# EAGLE design Enclosure 85x58 SP (EAGLE 9.6.2)
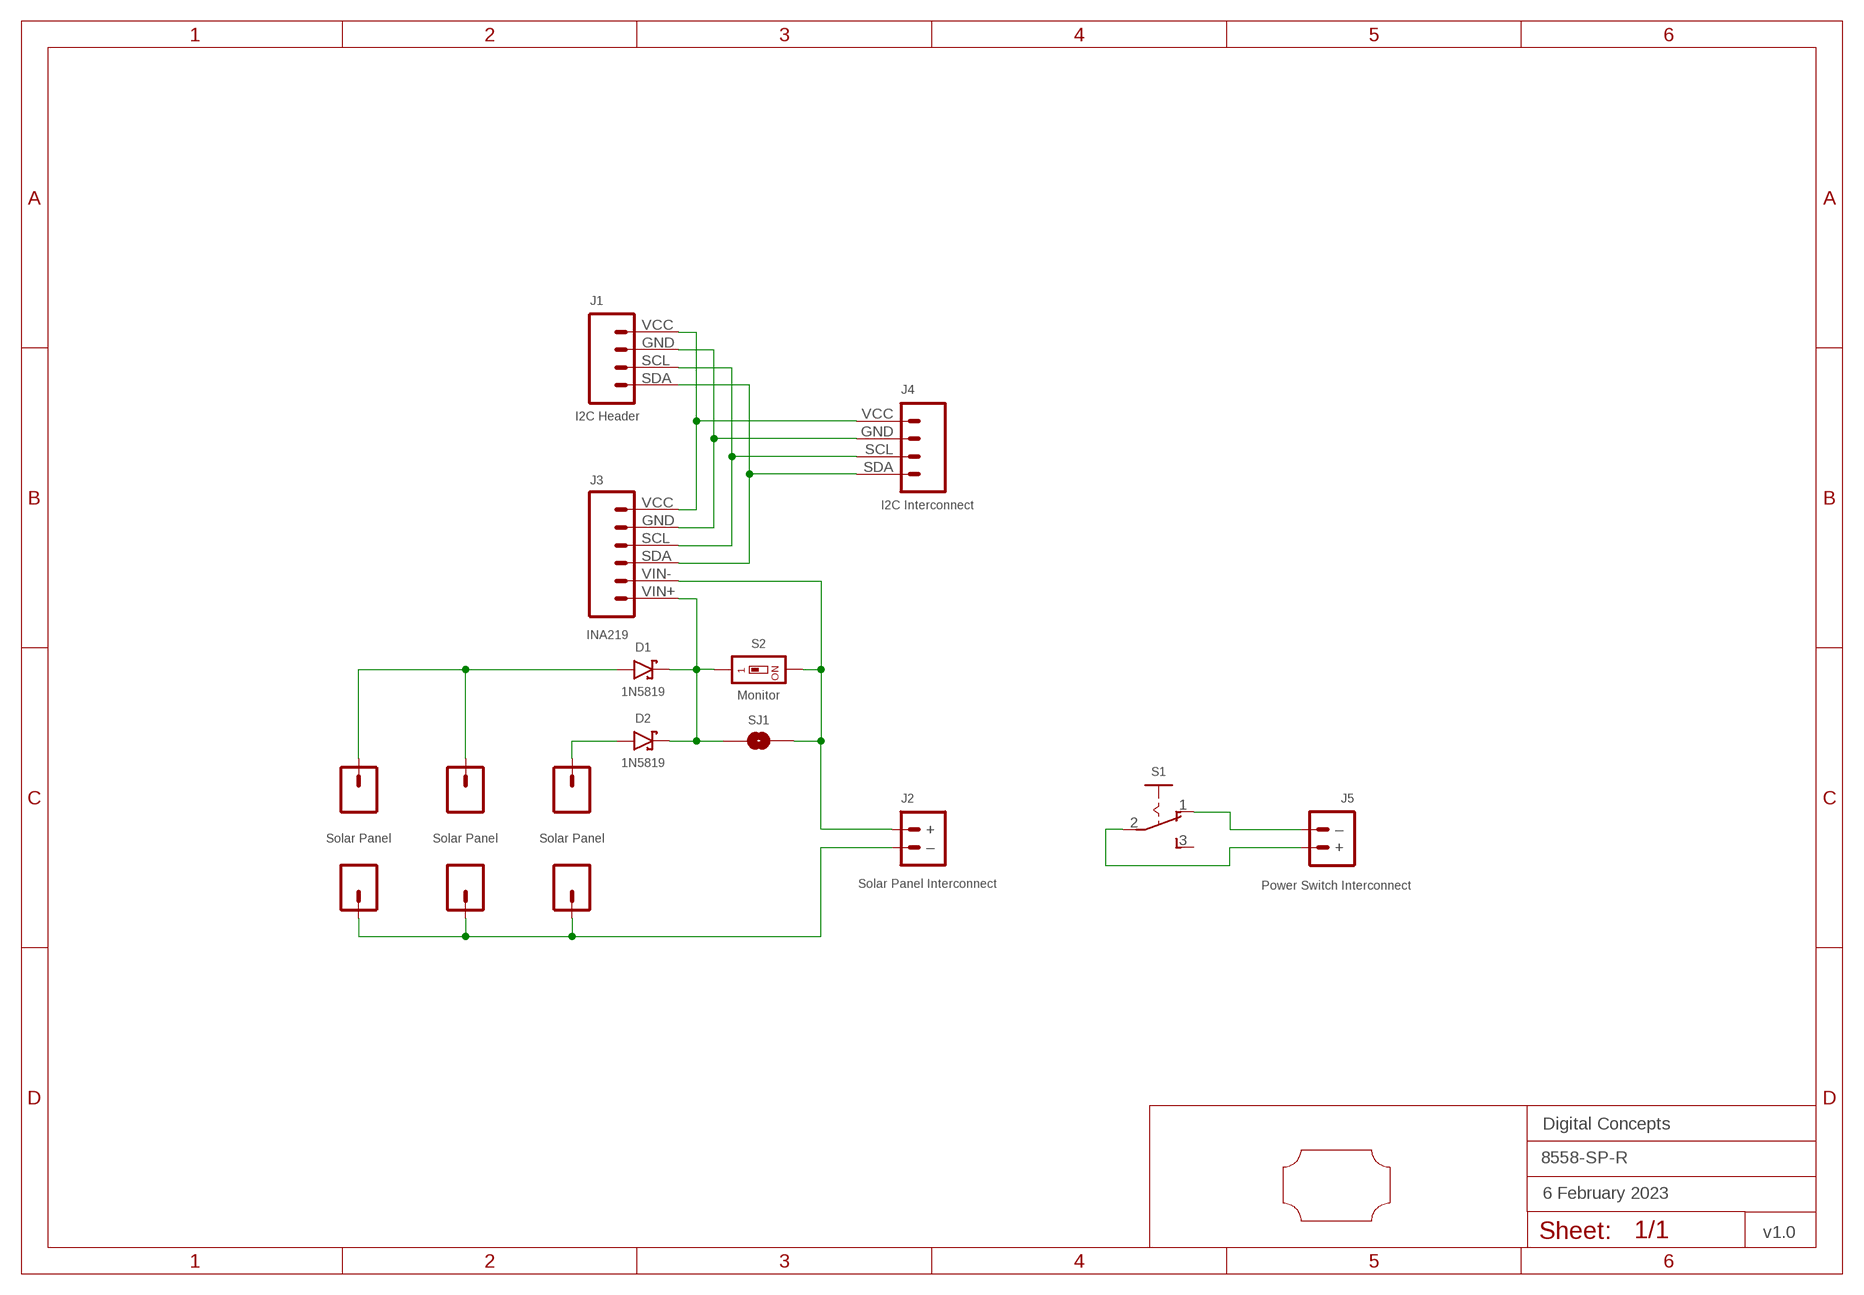
[diagram p0: schematic, sheet 1]
FRAME2 (FRAME-A4L-LOC): DATE: 6 February 2023; OWNER: Digital Concepts; TITLE: 8558-SP-R; VERSION: v1.0

## Parts
+  Solar Panel  PAD-SMD-GENERIC-SQUARE  [PAD-SMD-GENERIC]
+1  Solar Panel  PAD-SMD-GENERIC-SQUARE  [PAD-SMD-GENERIC]
+2  Solar Panel  PAD-SMD-GENERIC-SQUARE  [PAD-SMD-GENERIC]
-  Solar Panel  PAD-SMD-GENERIC-SQUARE  [PAD-SMD-GENERIC]
-1  Solar Panel  PAD-SMD-GENERIC-SQUARE  [PAD-SMD-GENERIC]
-2  Solar Panel  PAD-SMD-GENERIC-SQUARE  [PAD-SMD-GENERIC]
D1  1N5819  DIODE-SCHOTTKY-1N5819  [SOD-123]
D2  1N5819  DIODE-SCHOTTKY-1N5819  [SOD-123]
J1  I2C Header  HEADER-1X4-I2C  [CONN_04-I2C]
J2  Solar Panel Interconnect  JST-PH2.0-2-HORIZONTALJST-PTH-2  [JST-PH2.0-2-HORIZONTAL]
J3  INA219  INA219-I2C-MODULE  [CONN_06-INA219]
J4  I2C Interconnect  JST-PH2.0-4-I2C-HORIZONTAL  [JST-PH2.0-4-HORIZONTAL]
J5  Power Switch Interconnect  JST-PH2.0-2-HORIZONTALJST-PTH-2  [JST-PH2.0-2-HORIZONTAL]
S1  SWITCH-SLIDE-SPDT  [SWITCH-SPDT-PTH]
S2  Monitor  SWITCH-DIP-SWS001  [SMD-001]
SJ1  SJ  [SJ]
U$1  PROTO-28X18-SP  [PROTO-28X18-SP]

## Nets
GND: J1.GND J3.GND J4.GND
N$1: J1.SDA J3.SDA J4.SDA
N$2: J1.SCL J3.SCL J4.SCL
N$3: -1.P$1 -2.P$1 -.P$1 J2.2(–)
N$4: J2.1(+) J3.VIN- S2.2 SJ1.2
N$5: D1.C D2.C J3.VIN+ S2.1 SJ1.1
N$6: J5.1(+) S1.2(P)
N$7: +1.P$1 +2.P$1 D1.A
N$8: +.P$1 D2.A
N$9: J5.2(–) S1.1(O)
VCC: J1.VCC J3.VCC J4.VCC
Unconnected: S1.3(S)

## Library data of the parts
+ +1 +2 - -1 -2 = digitalconcepts:PAD-SMD-GENERIC-SQUARE: SMD Pad—Square
D1 D2 = digitalconcepts:DIODE-SCHOTTKY-1N5819: 1N5819 Schottky Diode SOD-123
J1 = digitalconcepts:HEADER-1X4-I2C: I2C Interface [Pin 1 Vcc] 4-Pin Header
J2 J5 = digitalconcepts:JST-PH2.0-2-HORIZONTAL: PH2.0 2P Right Angle PCB Connector; PROD_ID: CONN-09863; SKU: PRT-09914
J3 = digitalconcepts:INA219-I2C-MODULE: INA219 I2C Module
J4 = digitalconcepts:JST-PH2.0-4-I2C-HORIZONTAL: PH2.0 4P I2C Horizontal Connector
S1 = digitalconcepts:SWITCH-SLIDE-SPDT: Mini Sliding Switch SPDT
S2 = digitalconcepts:SWITCH-DIP-SWS001: SMD Dip Switch 1 pol.
SJ1 = digitalconcepts:SJ: Solder Jumper
U$1 = digitalconcepts:PROTO-28X18-SP: 28 x 18 Prototyping board to fit an 85 x 58 enclosure—Solar panel support

## Board
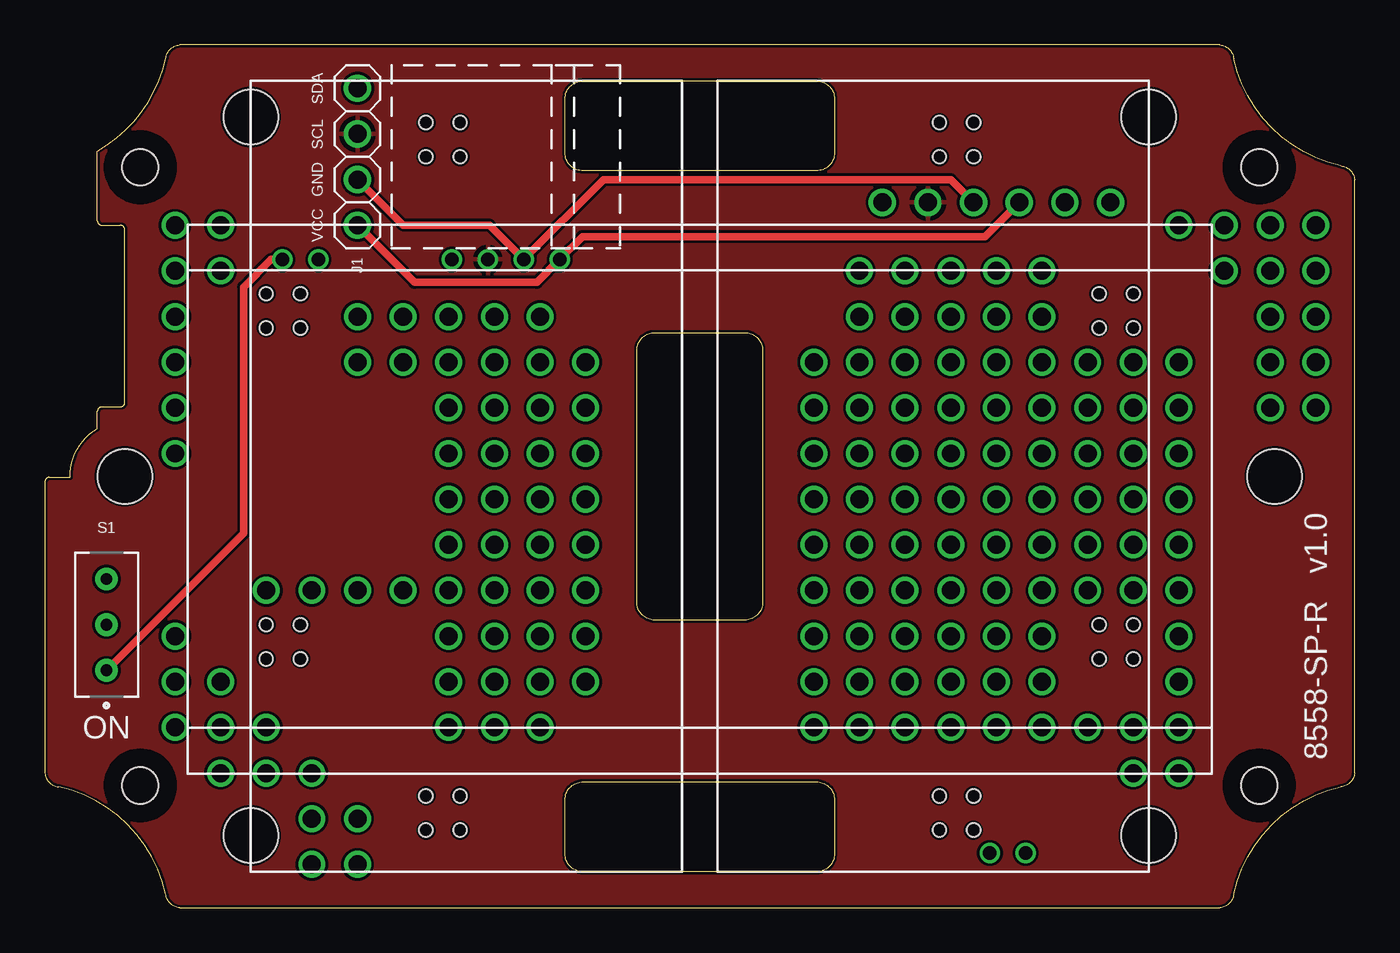
[diagram p1: board, top side]
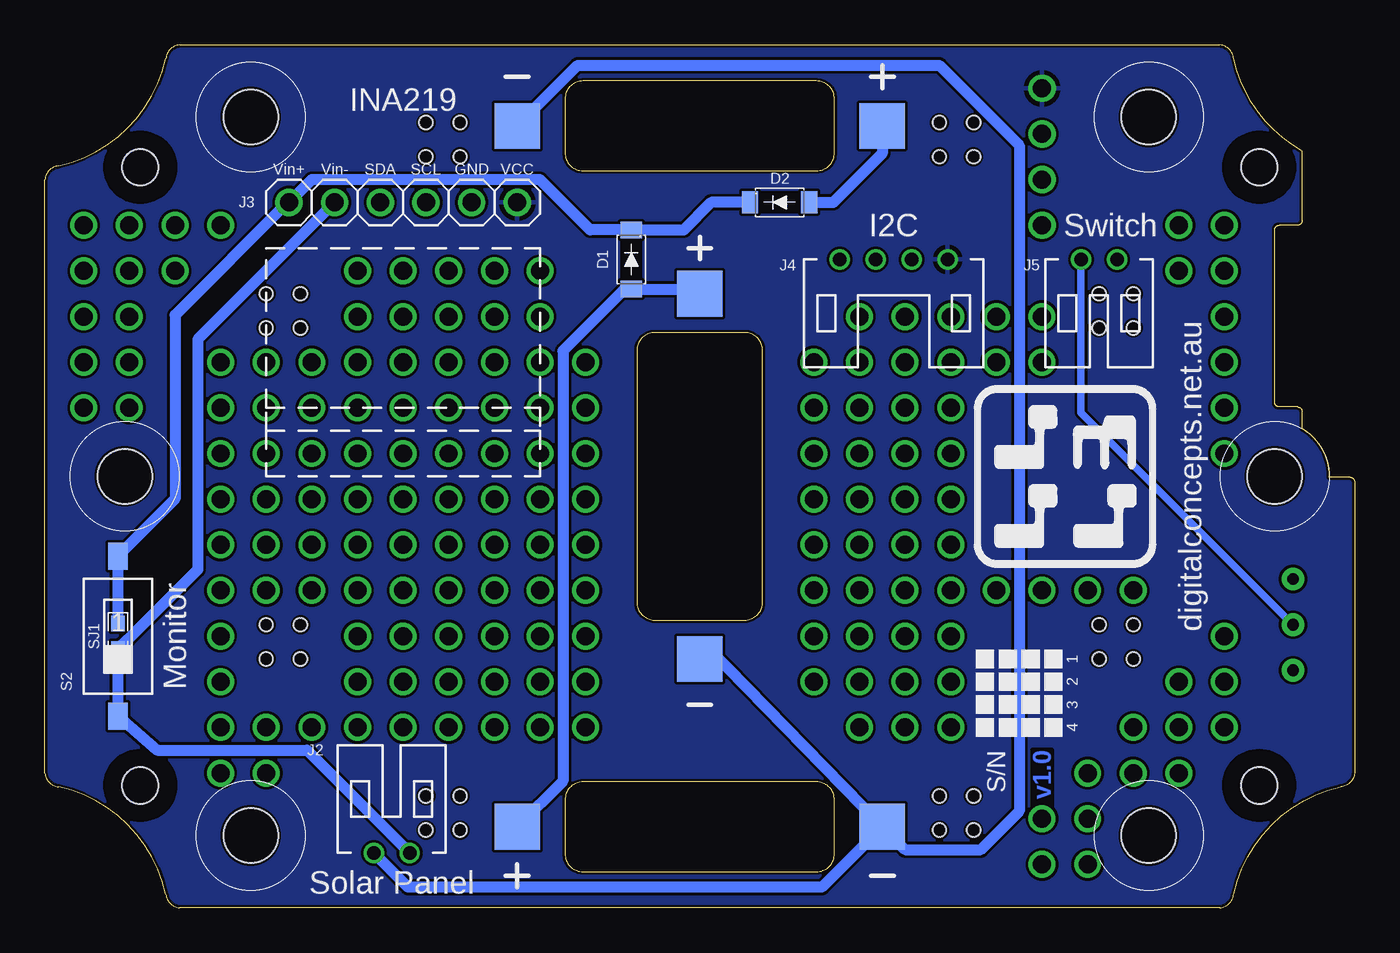
[diagram p2: board, bottom side, seen from below]

Size 72.9 x 48.01 mm. Coordinates in mm from the lower left corner, seen from the top.
Copper layers (1*16): Top 0.035mm / dielectric 1.5mm / Bottom 0.035mm
Design rules "default *": minimum track width 6mil, minimum drill 0.35mm, track to track 6mil, track to pad 6mil, pad to pad 6mil, via to via 6mil, smd to smd 6mil, copper to edge 6mil, drill to drill 6mil, minimum pad ring 1mil, minimum via ring 8mil, stop-mask expansion 4mil, vias tented up to drill 0mil, thermal gap 10mil

### Footprints (pad centres in the part's own frame; a part is rotated, then mirrored left to right if it is on the bottom)
PAD-SMD-GENERIC = smd 2.54 x 2.54: P$1 0,0
SOD-123 = smd 0.91 x 1.22: A -1.65,0; C 1.65,0
CONN_04-I2C = drill 1 pad 1.524: GND 2.54,0; SCL 5.08,0; SDA 7.62,0; VCC 0,0
JST-PH2.0-2-HORIZONTAL = drill 0.75: 1 1,0; 2 -1,0
CONN_06-INA219 = drill 1 pad 1.524: GND 2.54,0; SCL 5.08,0; SDA 7.62,0; VCC 0,0; VIN+ 12.7,0; VIN- 10.16,0
JST-PH2.0-4-HORIZONTAL = drill 0.75: GND -1,0; SCL 1,0; SDA 3,0; VCC -3,0
SWITCH-SPDT-PTH = drill 0.65 pad 1.27: 1 -2.54,0; 2 0,0; 3 2.54,0
SMD-001 = smd 1.1 x 1.5: 1 0,-4.45; 2 0,4.45
SJ = smd 0.864 x 0.762: 1 -0.711,0; 2 0.711,0
PROTO-28X18-SP = drill 1: P03-04 -29.21,-13.97; P03-05 -29.21,-11.43; P03-06 -29.21,-8.89; P03-10 -29.21,1.27; P03-11 -29.21,3.81; P03-12 -29.21,6.35; P03-13 -29.21,8.89; P03-14 -29.21,11.43; P03-15 -29.21,13.97; P04-03 -26.67,-16.51; P04-04 -26.67,-13.97; P04-05 -26.67,-11.43; P04-14 -26.67,11.43; P04-15 -26.67,13.97; P05-03 -24.13,-16.51; P05-04 -24.13,-13.97; P05-07 -24.13,-6.35; P06-01 -21.59,-21.59; P06-02 -21.59,-19.05; P06-03 -21.59,-16.51; P06-07 -21.59,-6.35; P07-01 -19.05,-21.59; P07-02 -19.05,-19.05; P07-07 -19.05,-6.35; P07-12 -19.05,6.35; P07-13 -19.05,8.89; P08-07 -16.51,-6.35; P08-12 -16.51,6.35; P08-13 -16.51,8.89; P09-04 -13.97,-13.97; P09-05 -13.97,-11.43; P09-06 -13.97,-8.89; P09-07 -13.97,-6.35; P09-08 -13.97,-3.81; P09-09 -13.97,-1.27; P09-10 -13.97,1.27; P09-11 -13.97,3.81; P09-12 -13.97,6.35; P09-13 -13.97,8.89; P10-04 -11.43,-13.97; P10-05 -11.43,-11.43; P10-06 -11.43,-8.89; P10-07 -11.43,-6.35; P10-08 -11.43,-3.81; P10-09 -11.43,-1.27; P10-10 -11.43,1.27; P10-11 -11.43,3.81; P10-12 -11.43,6.35; P10-13 -11.43,8.89; P11-04 -8.89,-13.97; P11-05 -8.89,-11.43; P11-06 -8.89,-8.89; P11-07 -8.89,-6.35; P11-08 -8.89,-3.81; P11-09 -8.89,-1.27; P11-10 -8.89,1.27; P11-11 -8.89,3.81; P11-12 -8.89,6.35; P11-13 -8.89,8.89; P12-05 -6.35,-11.43; P12-06 -6.35,-8.89; P12-07 -6.35,-6.35; P12-08 -6.35,-3.81; P12-09 -6.35,-1.27; P12-10 -6.35,1.27; P12-11 -6.35,3.81; P12-12 -6.35,6.35; P17-04 6.35,-13.97; P17-05 6.35,-11.43; P17-06 6.35,-8.89; P17-07 6.35,-6.35; P17-08 6.35,-3.81; P17-09 6.35,-1.27; P17-10 6.35,1.27; P17-11 6.35,3.81; P17-12 6.35,6.35; P18-04 8.89,-13.97; P18-05 8.89,-11.43; P18-06 8.89,-8.89; P18-07 8.89,-6.35; P18-08 8.89,-3.81; P18-09 8.89,-1.27; P18-10 8.89,1.27; P18-11 8.89,3.81; P18-12 8.89,6.35; P18-13 8.89,8.89; P18-14 8.89,11.43; P19-04 11.43,-13.97; P19-05 11.43,-11.43; P19-06 11.43,-8.89; P19-07 11.43,-6.35; P19-08 11.43,-3.81; P19-09 11.43,-1.27; P19-10 11.43,1.27; P19-11 11.43,3.81; P19-12 11.43,6.35; P19-13 11.43,8.89; P19-14 11.43,11.43; P20-04 13.97,-13.97; P20-05 13.97,-11.43; P20-06 13.97,-8.89; P20-07 13.97,-6.35; P20-08 13.97,-3.81; P20-09 13.97,-1.27; P20-10 13.97,1.27; P20-11 13.97,3.81; P20-12 13.97,6.35; P20-13 13.97,8.89; P20-14 13.97,11.43; P21-04 16.51,-13.97; P21-05 16.51,-11.43; P21-06 16.51,-8.89; P21-07 16.51,-6.35; P21-08 16.51,-3.81; P21-09 16.51,-1.27; P21-10 16.51,1.27; P21-11 16.51,3.81; P21-12 16.51,6.35; P21-13 16.51,8.89; P21-14 16.51,11.43; P22-04 19.05,-13.97; P22-05 19.05,-11.43; P22-06 19.05,-8.89; P22-07 19.05,-6.35; P22-08 19.05,-3.81; P22-09 19.05,-1.27; P22-10 19.05,1.27; P22-11 19.05,3.81; P22-12 19.05,6.35; P22-13 19.05,8.89; P22-14 19.05,11.43; P23-04 21.59,-13.97; P23-07 21.59,-6.35; P23-08 21.59,-3.81; P23-09 21.59,-1.27; P23-10 21.59,1.27; P23-11 21.59,3.81; P23-12 21.59,6.35; P24-03 24.13,-16.51; P24-04 24.13,-13.97; P24-07 24.13,-6.35; P24-08 24.13,-3.81; P24-09 24.13,-1.27; P24-10 24.13,1.27; P24-11 24.13,3.81; P24-12 24.13,6.35; P25-03 26.67,-16.51; P25-04 26.67,-13.97; P25-05 26.67,-11.43; P25-06 26.67,-8.89; P25-07 26.67,-6.35; P25-08 26.67,-3.81; P25-09 26.67,-1.27; P25-10 26.67,1.27; P25-11 26.67,3.81; P25-12 26.67,6.35; P25-15 26.67,13.97; P26-14 29.21,11.43; P26-15 29.21,13.97; P27-11 31.75,3.81; P27-12 31.75,6.35; P27-13 31.75,8.89; P27-14 31.75,11.43; P27-15 31.75,13.97; P28-11 34.29,3.81; P28-12 34.29,6.35; P28-13 34.29,8.89; P28-14 34.29,11.43; P28-15 34.29,13.97 | hole 2.032: -31.14,17.196; -31.14,-17.196; 31.14,-17.196; 31.14,17.196 | hole 3.048: -24.994,19.99; -32.004,0; -24.994,-19.99; 24.994,-19.99; 32.004,0; 24.994,19.99 | hole 0.75: -15.24,19.685; -13.335,19.685; -13.335,17.78; -15.24,17.78; 13.335,19.685; 15.24,19.685; 15.24,17.78; 13.335,17.78; 13.335,-17.78; 15.24,-17.78; 15.24,-19.685; 13.335,-19.685; -15.24,-17.78; -13.335,-17.78; -13.335,-19.685; -15.24,-19.685; -24.13,10.16; -22.225,10.16; -22.225,8.255; -24.13,8.255; 22.225,10.16; 24.13,10.16; 24.13,8.255; 22.225,8.255; 22.225,-8.255; 24.13,-8.255; 24.13,-10.16; 22.225,-10.16; -24.13,-8.255; -22.225,-8.255; -22.225,-10.16; -24.13,-10.16

### Placement (x,y rotation side)
+  26.29,43.5 0 bottom
+1  46.61,4.5 0 bottom
+2  36.45,34.16 0 bottom
-  46.61,43.5 0 bottom
-1  26.29,4.5 0 bottom
-2  36.45,13.84 0 bottom
D1  40.26,36.07 90 bottom
D2  32,39.24 180 bottom
J1  17.4,45.59 270 top
J2  53.59,3.05 0 bottom
J3  46.61,39.24 180 bottom
J4  25.65,36.07 180 bottom
J5  14.22,36.07 180 bottom
S1  3.43,15.75 90 top
S2  68.83,15.11 180 bottom
SJ1  68.83,15.11 270 bottom
U$1  36.45,24 0 top

### Tracks (layer width: path | path; a pad name or v marks a point on that pad's centre or on a via)
$X0
  cutout Bottom: 5.31,43.23 arc180 5.31,39.17 arc180
$X1
  cutout Bottom: 67.59,43.23 arc180 67.59,39.17 arc180
$X2
  cutout Bottom: 67.59,8.84 arc180 67.59,4.78 arc180
$X3
  cutout Bottom: 5.31,8.84 arc180 5.31,4.78 arc180
$X4
  cutout Top: 5.31,43.23 arc180 5.31,39.17 arc180
$X5
  cutout Top: 67.59,43.23 arc180 67.59,39.17 arc180
$X6
  cutout Top: 67.59,8.84 arc180 67.59,4.78 arc180
$X7
  cutout Top: 5.31,8.84 arc180 5.31,4.78 arc180
GND
  pour Top: -1.65,49.4 74.55,49.4 74.55,-1.4 -1.65,-1.4
N$1
  Top 0.406: J1.SDA 20.57,34.8 27.38,34.8 J4.SDA 29.92,37.34 52.32,37.34 J3.SDA
N$2
  Top 0.406: J1.SCL 19.94,37.97 24.75,37.97 J4.SCL 31.1,40.51 50.42,40.51 J3.SCL
N$3
  Bottom 0.61: -2.P$1 36,14.48 -1.P$1 | -1.P$1 29.65,1.14 52.69,1.14 J2.2 | -.P$1 43.25,46.86 23.11,46.86 18.67,42.42 18.67,5.37 20.8,3.23 25.02,3.23 -1.P$1
N$4
  Bottom 0.61: J2.1 58.31,8.76 66.65,8.76 68.82,10.66 S2.2 SJ1.2 68.3,14.94 68.26,14.94 64.39,18.81 64.39,31.62 J3.VIN-
N$5
  Bottom 0.61: SJ1.1 S2.1 65.66,22.73 65.66,32.97 59.38,39.24 J3.VIN+ 58.04,40.51 45.34,40.51 42.54,37.72 D1.C 37.34,37.72 35.81,39.24 D2.C
N$6
  Bottom 0.406: J5.1 15.22,27.54 S1.2
N$7
  Bottom 0.61: +2.P$1 36.83,34.16 37.08,34.42 D1.A 40.64,34.42 44.07,30.99 44.07,7.04 +1.P$1
N$8
  Bottom 0.61: D2.A 29.01,39.24 26.29,41.97 +.P$1
N$9
  Top 0.406: J5.2 12.59,36.07 11.05,34.53 11.05,20.83 S1.1
VCC
  pour Bottom (rank 5): -1.02,48.77 73.91,48.77 73.91,-0.76 -1.02,-0.76

### Text on the board
Bottom: v1.0
tPlace: SDA | SCL | GND | VCC | 8558-SP-R v1.0 | ON
bPlace: VCC | GND | SCL | SDA | Vin- | Vin+ | digitalconcepts.net.au | 1 | 2 | 3 | 4 | S/N
bNames: Switch | I2C | Solar Panel